# EasyEDA schematic 1-Schematic_Bluetonium canister.json
TITLE: Sheet_1; REV: 1.0; Date: 2023-09-16; Sheet: 1/1; Company: Your Company
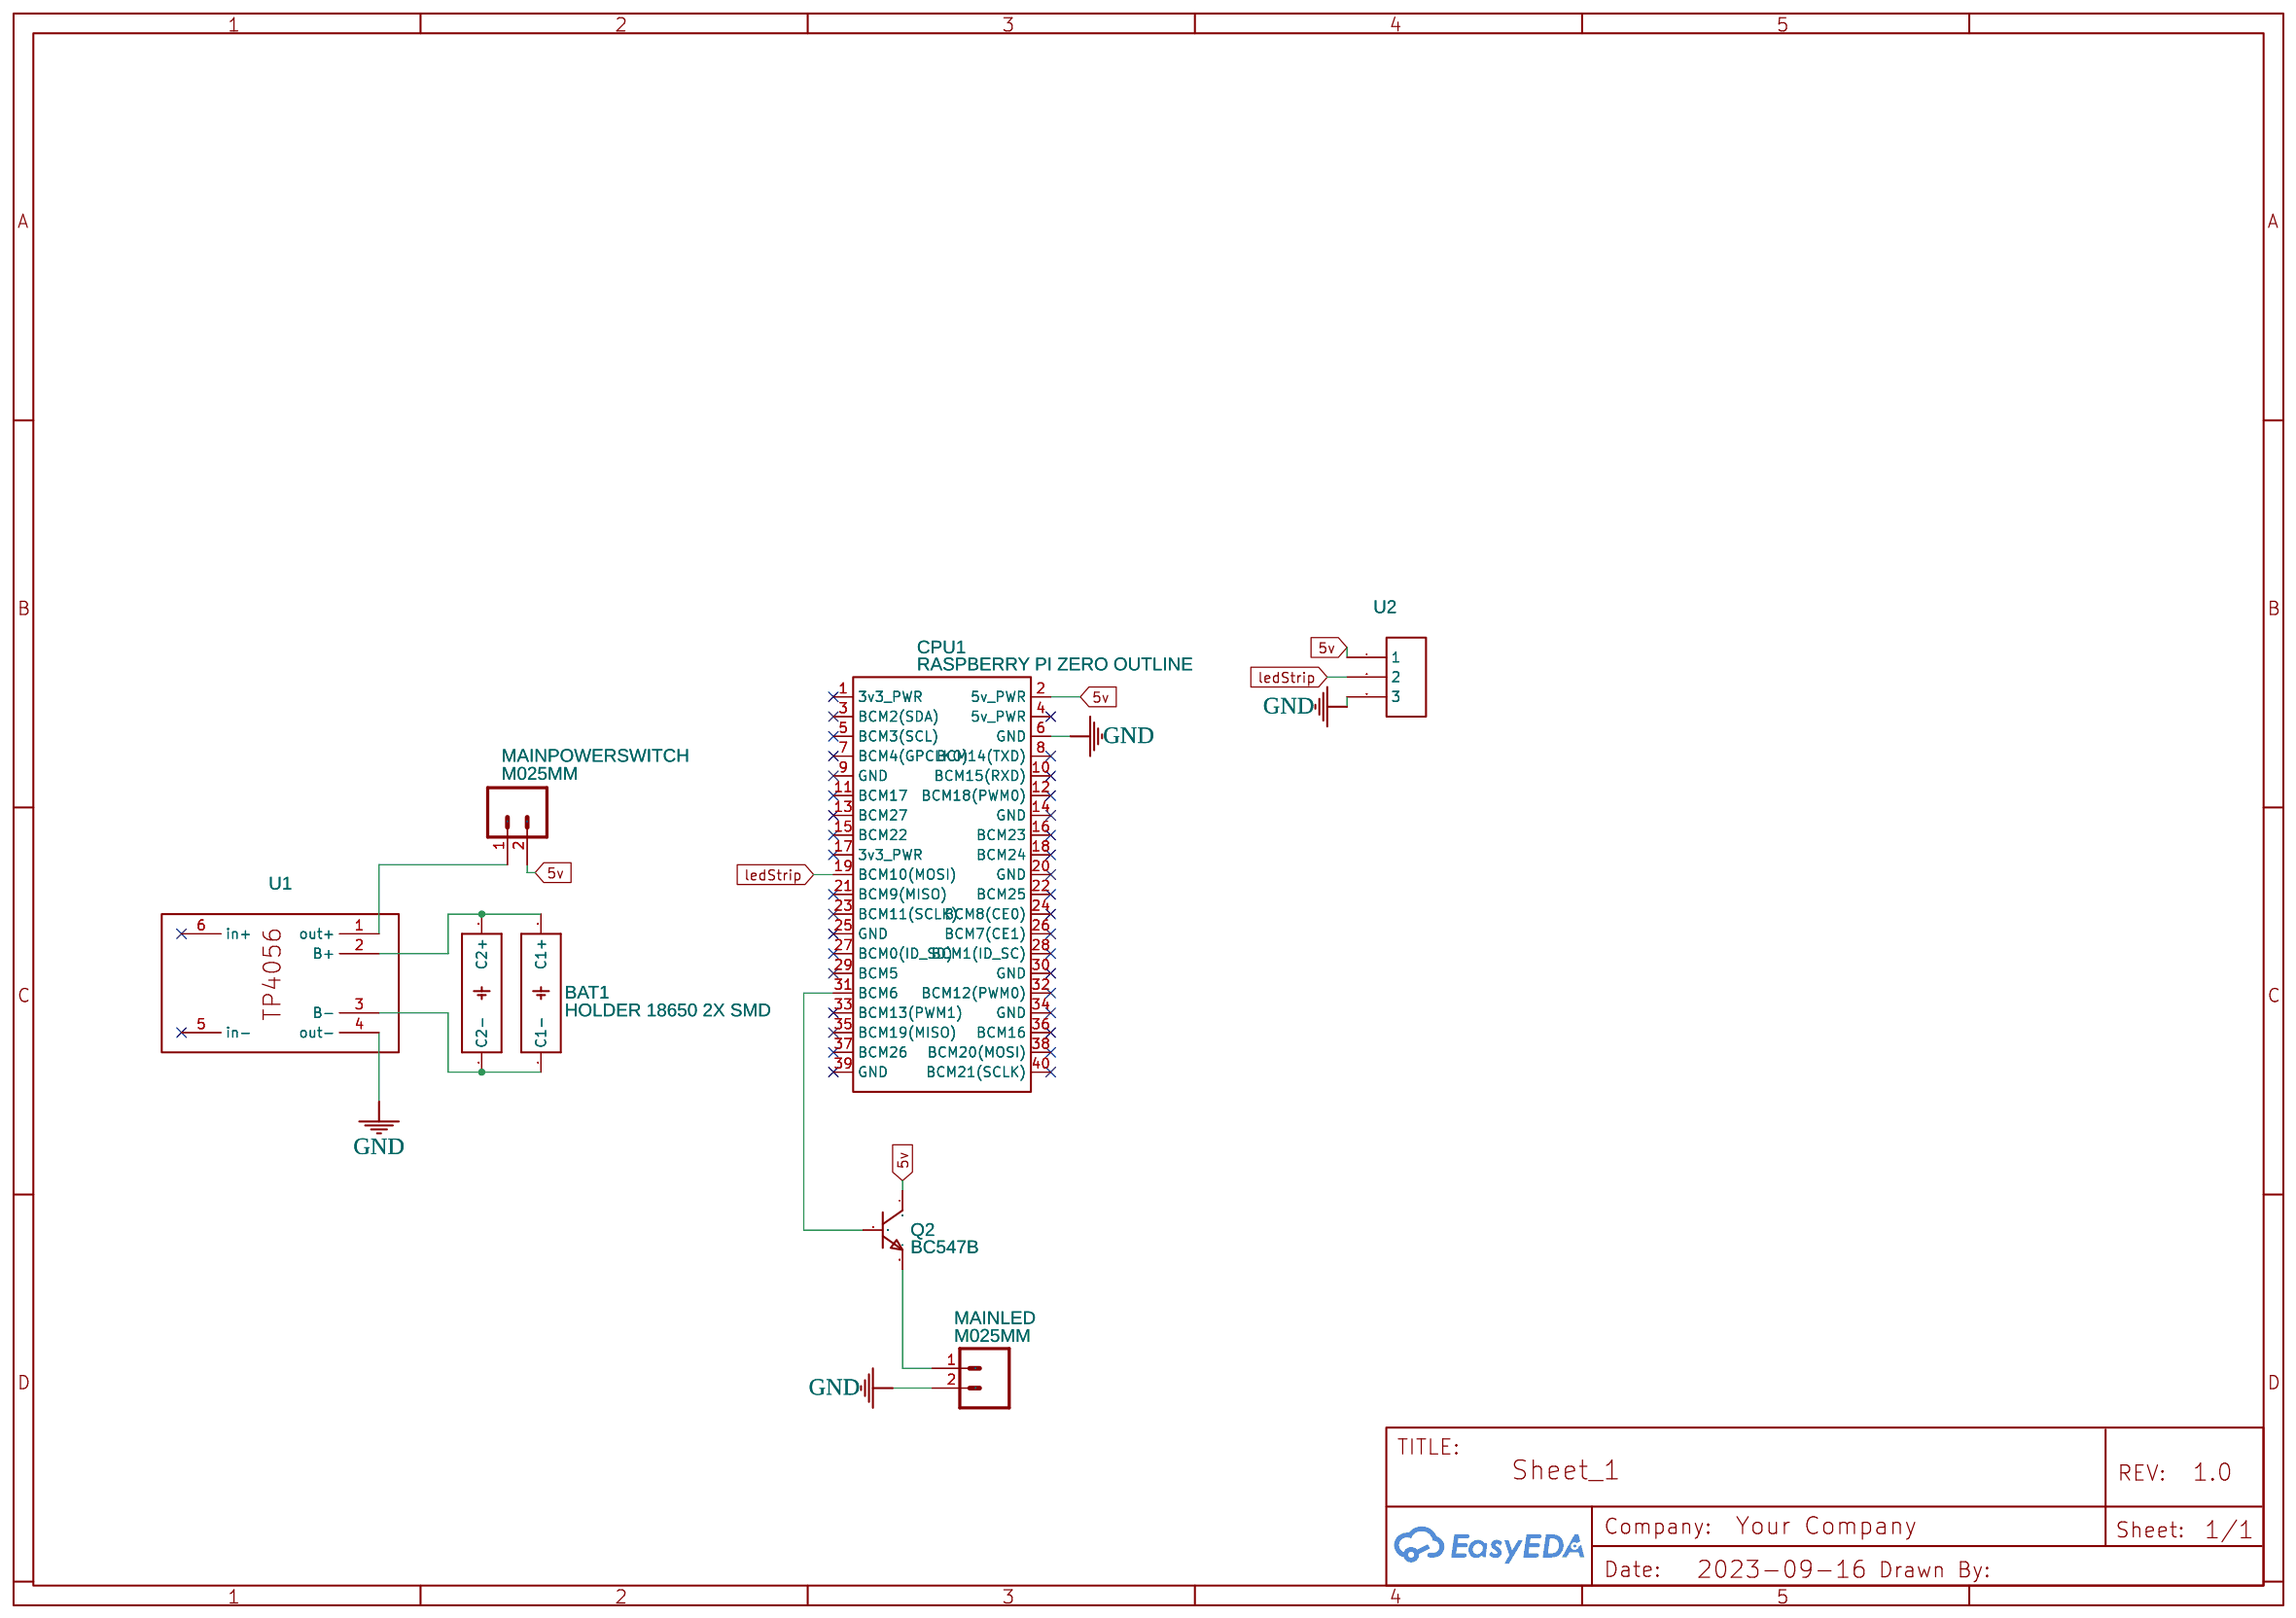
[diagram p0: schematic sheet]

## Parts
BAT1  HOLDER 18650 2X SMD  [HOLDER 18650 2X SMD]
CPU1  RASPBERRY PI ZERO OUTLINE  [RASPBERRY-PI-ZERO]
MAINLED  M025MM  [SCREWTERMINAL-5MM-2]
MAINPOWERSWITCH  M025MM  [SCREWTERMINAL-5MM-2]
Q2  BC547B  [TRANSISTOR NPN/PNP]
U1  NO  [TP4056]
U2  NO  [PORT-3PIN-P2.54]

## Library data of the parts
BAT1 = HOLDER 18650 2X SMD: Contributor: Rodrigo Venegas
CPU1 = RASPBERRY PI ZERO OUTLINE: Manufacturer: Raspberry Pi; Manufacturer Part: Pi Zero W; Supplier: Adafruit; Supplier Part: 3400; link: https://www.adafruit.com/product/3400; Contributor: lordzurp
MAINLED MAINPOWERSWITCH = M025MM: Contributor: Mohammad Yusuf Syafroni Karim
Q2 = BC547B: Supplier: Element14; Manufacturer: MULTICOMP; Contributor: za4010g; Supplier Part: 1574381
U1 = TP4056: Contributor: petewedi
U2 = PORT-3PIN-P2.54: Contributor: gdespagne

## Nets
5v: CPU1.2(5v PWR) MAINPOWERSWITCH.2 Q2.1(C) U2.1
GND: CPU1.6(GND) MAINLED.2 U1.4(out-) U2.3
ledStrip: CPU1.19(BCM10(MOSI)) U2.2
Net-(BAT1-1+): BAT1.1+(C1+) BAT1.2+(C2+) U1.2(B+)
Net-(BAT1-1-): BAT1.1-(C1-) BAT1.2-(C2-) U1.3(B-)
Net-(CPU1-31): CPU1.31(BCM6) Q2.2(B)
Net-(MAINLED-1): MAINLED.1 Q2.3(E)
Net-(MAINPOWERSWITCH-1): MAINPOWERSWITCH.1 U1.1(out+)

Not connected (* = marked no-connect by the designer): CPU1 1(3v3 PWR)* 3(BCM2(SDA))* 4(5v PWR)* 5(BCM3(SCL))* 7(BCM4(GPCLK0))* 8(BCM14(TXD))* 9(GND)* 10(BCM15(RXD))* 11(BCM17)* 12(BCM18(PWM0))* 13(BCM27)* 14(GND)* 15(BCM22)* 16(BCM23)* 17(3v3 PWR)* 18(BCM24)* 20(GND)* 21(BCM9(MISO))* 22(BCM25)* 23(BCM11(SCLK))* 24(BCM8(CE0))* 25(GND)* 26(BCM7(CE1))* 27(BCM0(ID_SD))* 28(BCM1(ID_SC))* 29(BCM5)* 30(GND)* 32(BCM12(PWM0))* 33(BCM13(PWM1))* 34(GND)* 35(BCM19(MISO))* 36(BCM16)* 37(BCM26)* 38(BCM20(MOSI))* 39(GND)* 40(BCM21(SCLK))*; U1 5(in-)* 6(in+)*
